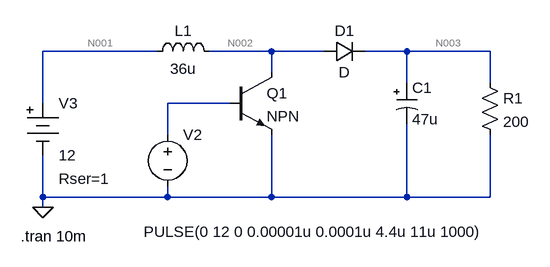
[diagram p0: schematic 12-20UpConverter.asc]
12-20UpConverter.asc, the LTspice schematic file:
Version 4
SHEET 1 880 680
WIRE 96 112 -80 112
WIRE 272 112 176 112
WIRE 352 112 272 112
WIRE 480 112 416 112
WIRE 608 112 480 112
WIRE 272 144 272 112
WIRE 480 160 480 112
WIRE 608 160 608 112
WIRE -80 192 -80 112
WIRE 208 192 112 192
WIRE 112 240 112 192
WIRE -80 336 -80 272
WIRE 112 336 112 320
WIRE 112 336 -80 336
WIRE 272 336 272 240
WIRE 272 336 112 336
WIRE 480 336 480 224
WIRE 480 336 272 336
WIRE 608 336 608 240
WIRE 608 336 480 336
WIRE -80 352 -80 336
FLAG -80 352 0
SYMBOL ind 80 128 R270
WINDOW 0 32 56 VTop 2
WINDOW 3 5 56 VBottom 2
SYMATTR InstName L1
SYMATTR Value 36u
SYMBOL polcap 464 160 R0
SYMATTR InstName C1
SYMATTR Value 47u
SYMBOL res 592 144 R0
SYMATTR InstName R1
SYMATTR Value 200
SYMBOL voltage 112 224 R0
WINDOW 3 -37 165 Left 2
WINDOW 123 0 0 Left 0
WINDOW 39 0 0 Left 0
SYMATTR InstName V2
SYMATTR Value PULSE(0 12 0 0.00001u 0.0001u 4.4u 11u 1000)
SYMBOL diode 352 128 R270
WINDOW 0 32 32 VTop 2
WINDOW 3 0 32 VBottom 2
SYMATTR InstName D1
SYMBOL Misc\\battery -80 176 R0
WINDOW 123 0 0 Left 0
WINDOW 39 24 132 Left 2
SYMATTR InstName V3
SYMATTR Value 12
SYMATTR SpiceLine Rser=1
SYMBOL npn2 208 144 R0
SYMATTR InstName Q1
TEXT -114 396 Left 2 !.tran 10m

The netlist it stands for:
* 12-20UpConverter.asc
L1 N001 N002 36u
C1 N003 0 47u
R1 N003 0 200
V2 N004 0 PULSE(0 12 0 0.00001u 0.0001u 4.4u 11u 1000)
D1 N002 N003 D
V3 N001 0 12 Rser=1
Q1 N002 N004 0 0 NPN
.model D D
.lib standard.dio
.model NPN NPN
.model PNP PNP
.lib standard.bjt
.tran 10m
.backanno
.end

* Results of the author's LTspice run, read from the files saved beside the schematic
* Operating Point, zero values left out:
*   V(n001) = 11.94 V
*   V(n002) = 11.94 V
*   V(n003) = 11.18 V
*   Ic(Q1) = 11.94 pA
*   Ib(Q1) = -11.94 pA
*   I(D1) = 55.92 mA
*   I(L1) = 55.92 mA
*   I(R1) = 55.92 mA
*   I(V3) = -55.92 mA
*   I(V2) = 11.94 pA